# Altium project 崔文轩.PrjPCB
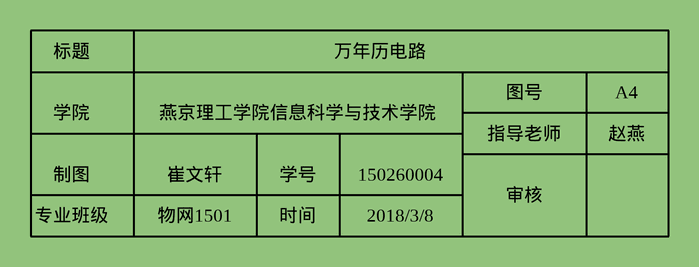
[diagram p0: 崔文轩.SchDoc]
2 sheets, 16 parts. Net scope: global (net labels, ports and power ports of the same name join across sheets).
Board files: 崔文轩.PcbDoc, 遮挡式红外声光报警装置电路.PcbDoc
Sheets:
  崔文轩.SchDoc
  遮挡式红外声光报警装置电路.SchDoc

## Sheet 崔文轩.SchDoc
size A0

### Notes on the sheet
- 标题
- 万年历电路
- 学院
- 燕京理工学院信息科学与技术学院
- 图号
- 指导老师
- A4
- 赵燕
- 制图
- 专业班级
- 崔文轩
- 物网1501
- 学号
- 时间
- 150260004
- 2018/3/8
- 审核

## Sheet 遮挡式红外声光报警装置电路.SchDoc
size A4; Author: 崔文轩
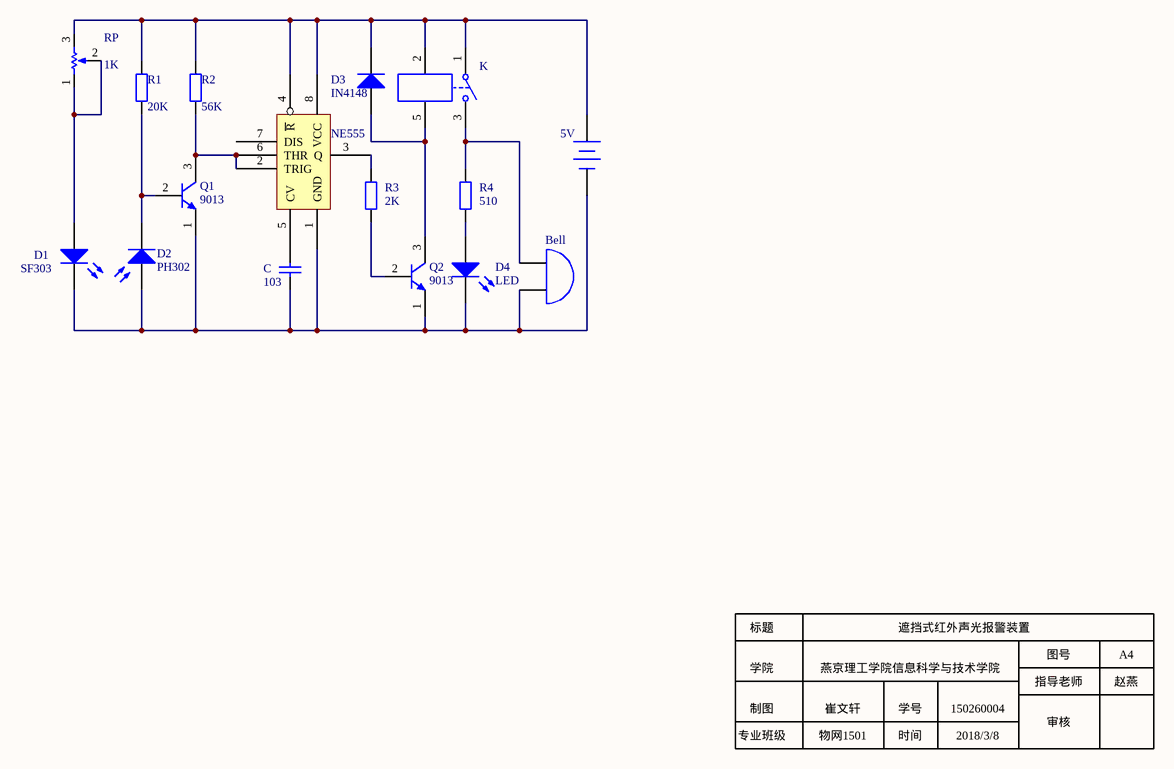
[diagram p1: 遮挡式红外声光报警装置电路.SchDoc]

### Parts
5V  Battery  [PIN2]  (value not drawn)
Bell  Bell  [RB7.6-15]  (value not drawn)
C  value 103  [RAD-0.3]  (hidden comment: Cap)
D1  SF303  [SE303]
D2  PH302  [PH302]
D3  IN4148  [DO-35]
D4  LED  [SE303]
K  Relay-SPST  [K6]  (value not drawn)
Q1  9013  [TO-92A]
Q2  9013  [TO-92A]
R1  value 20K  [AXIAL-0.4]  (hidden comment: Res2)
R2  value 56K  [AXIAL-0.4]  (hidden comment: Res2)
R3  value 2K  [AXIAL-0.4]  (hidden comment: Res2)
R4  value 510  [AXIAL-0.4]  (hidden comment: Res2)
RP  value 1K  [VR5]
U1  NE555  [DIP-8]

### Nets
Net5V_1: 5V.1(+) D3.2(K) K.1 K.2 R1.2 R2.2 RP.3(BOT) U1.4(~{R}) U1.8(VCC)
Net5V_2: 5V.2(-) Bell.2(B) C.2 D1.2(K) D2.1(A) D4.2(K) Q1.1(E) Q2.1(E) U1.1(GND)
NetBell_1: Bell.1(A) K.3 R4.2
NetC_1: C.1 U1.5(CV)
NetD1_1: D1.1(A) RP.1(TOP) RP.2(TAP)
NetD2_2: D2.2(K) Q1.2(B) R1.1
NetD3_1: D3.1(A) K.5 Q2.3(C)
NetD4_1: D4.1(A) R4.1
NetQ1_3: Q1.3(C) R2.1 U1.2(TRIG) U1.6(THR)
NetQ2_2: Q2.2(B) R3.1
NetR3_2: R3.2 U1.3(Q)

Not connected (* = marked no-connect by the designer): U1 7(DIS)

### Notes on the sheet
- 标题
- 学院
- 燕京理工学院信息科学与技术学院
- 遮挡式红外声光报警装置
- 图号
- A4
- 制图
- 专业班级
- 崔文轩
- 物网1501
- 学号
- 时间
- 150260004
- 2018/3/8
- 指导老师
- 审核
- 赵燕

### Library data of the parts
5V = Battery: Multicell Battery; Published: 24-Mar-1999; LatestRevisionDate: 17-Jul-2002; LatestRevisionNote: Re-released for DXP Platform.; PackageReference: BAT-2; Publisher: Altium Limited; PackageDescription: Battery; 2 Leads
Bell = Bell: Electrical Bell; Published: 24-Mar-1999; LatestRevisionDate: 17-Jul-2002; LatestRevisionNote: Re-released for DXP Platform.; PackageReference: PIN2; Publisher: Altium Limited
C = Cap: Capacitor; Published: 8-Jun-2000; LatestRevisionDate: 17-Jul-2002; LatestRevisionNote: Re-released for DXP Platform.; PackageReference: RAD-0.3; Publisher: Altium Limited; PackageDescription: Radial Cap, Thru-Hole; 2 Leads; 0.3 in Pin Spacing
D1 D4 = LED0: Typical INFRARED GaAs LED; Published: 8-Jun-2000; LatestRevisionDate: 08-Jul-2005; LatestRevisionNote: Mech Layer 1 removed.; PackageReference: LED-0; Publisher: Altium Limited; PackageDescription: LED; 2 Leads
D2 = Photo Sen: Photosensitive Diode; Published: 24-Mar-1999; LatestRevisionDate: 17-Jul-2002; LatestRevisionNote: Re-released for DXP Platform.; PackageReference: PIN2; Publisher: Altium Limited
D3 = Diode: Default Diode; Published: 8-Jun-2000; LatestRevisionDate: 17-Jul-2002; LatestRevisionNote: Re-released for DXP Platform.; PackageVersion: Sep-1996; PackageReference: SMC; Publisher: Altium Limited; PackageDescription: DO-214-AB/SMC; 2 C-Bend Leads; Body 7.9 x 5.9 mm, inc. leads (LxW); Code_JEDEC: DO-214-AB
K = Relay-SPST: Single-Pole Single-Throw Relay; Published: 24-Mar-1999; LatestRevisionDate: 17-Jul-2002; LatestRevisionNote: Re-released for DXP Platform.; PackageReference: MODULE4; Publisher: Altium Limited
Q1 Q2 = QNPN: NPN Bipolar Transistor; Published: 8-Jun-2000; LatestRevisionDate: 29-May-2009; LatestRevisionNote: IPC-7351 Footprint Added.; PackageVersion: Aug-1999; PackageReference: SOT-23B; Publisher: Altium Limited; PackageDescription: 3-Pin SOT-23 Package 0.95 mm Pitch, 2.4 mm Lead Span
R1-R4 = Res2: Resistor; Published: 8-Jun-2000; LatestRevisionDate: 17-Jul-2002; LatestRevisionNote: Re-released for DXP Platform.; PackageReference: AXIAL-0.4; Publisher: Altium Limited; PackageDescription: Axial Device, Thru-Hole; 2 Leads; 0.4 in Pin Spacing
RP = RPot: Potentiometer; Sim Note: Enter the Resistance value and the set point into parameter fields.; Set Position: 0.5; Published: 8-Jun-2000; LatestRevisionDate: 17-Jul-2002; LatestRevisionNote: Re-released for DXP Platform.; PackageReference: VR5; Publisher: Altium Limited; PackageDescription: Variable Resistor, Thru-Hole; 3 Leads